# Altium schematic sheet RFID_V2.SchDoc: RFID IC
size 420 x 297 mm; SheetNumber: 2; SheetTotal: 3
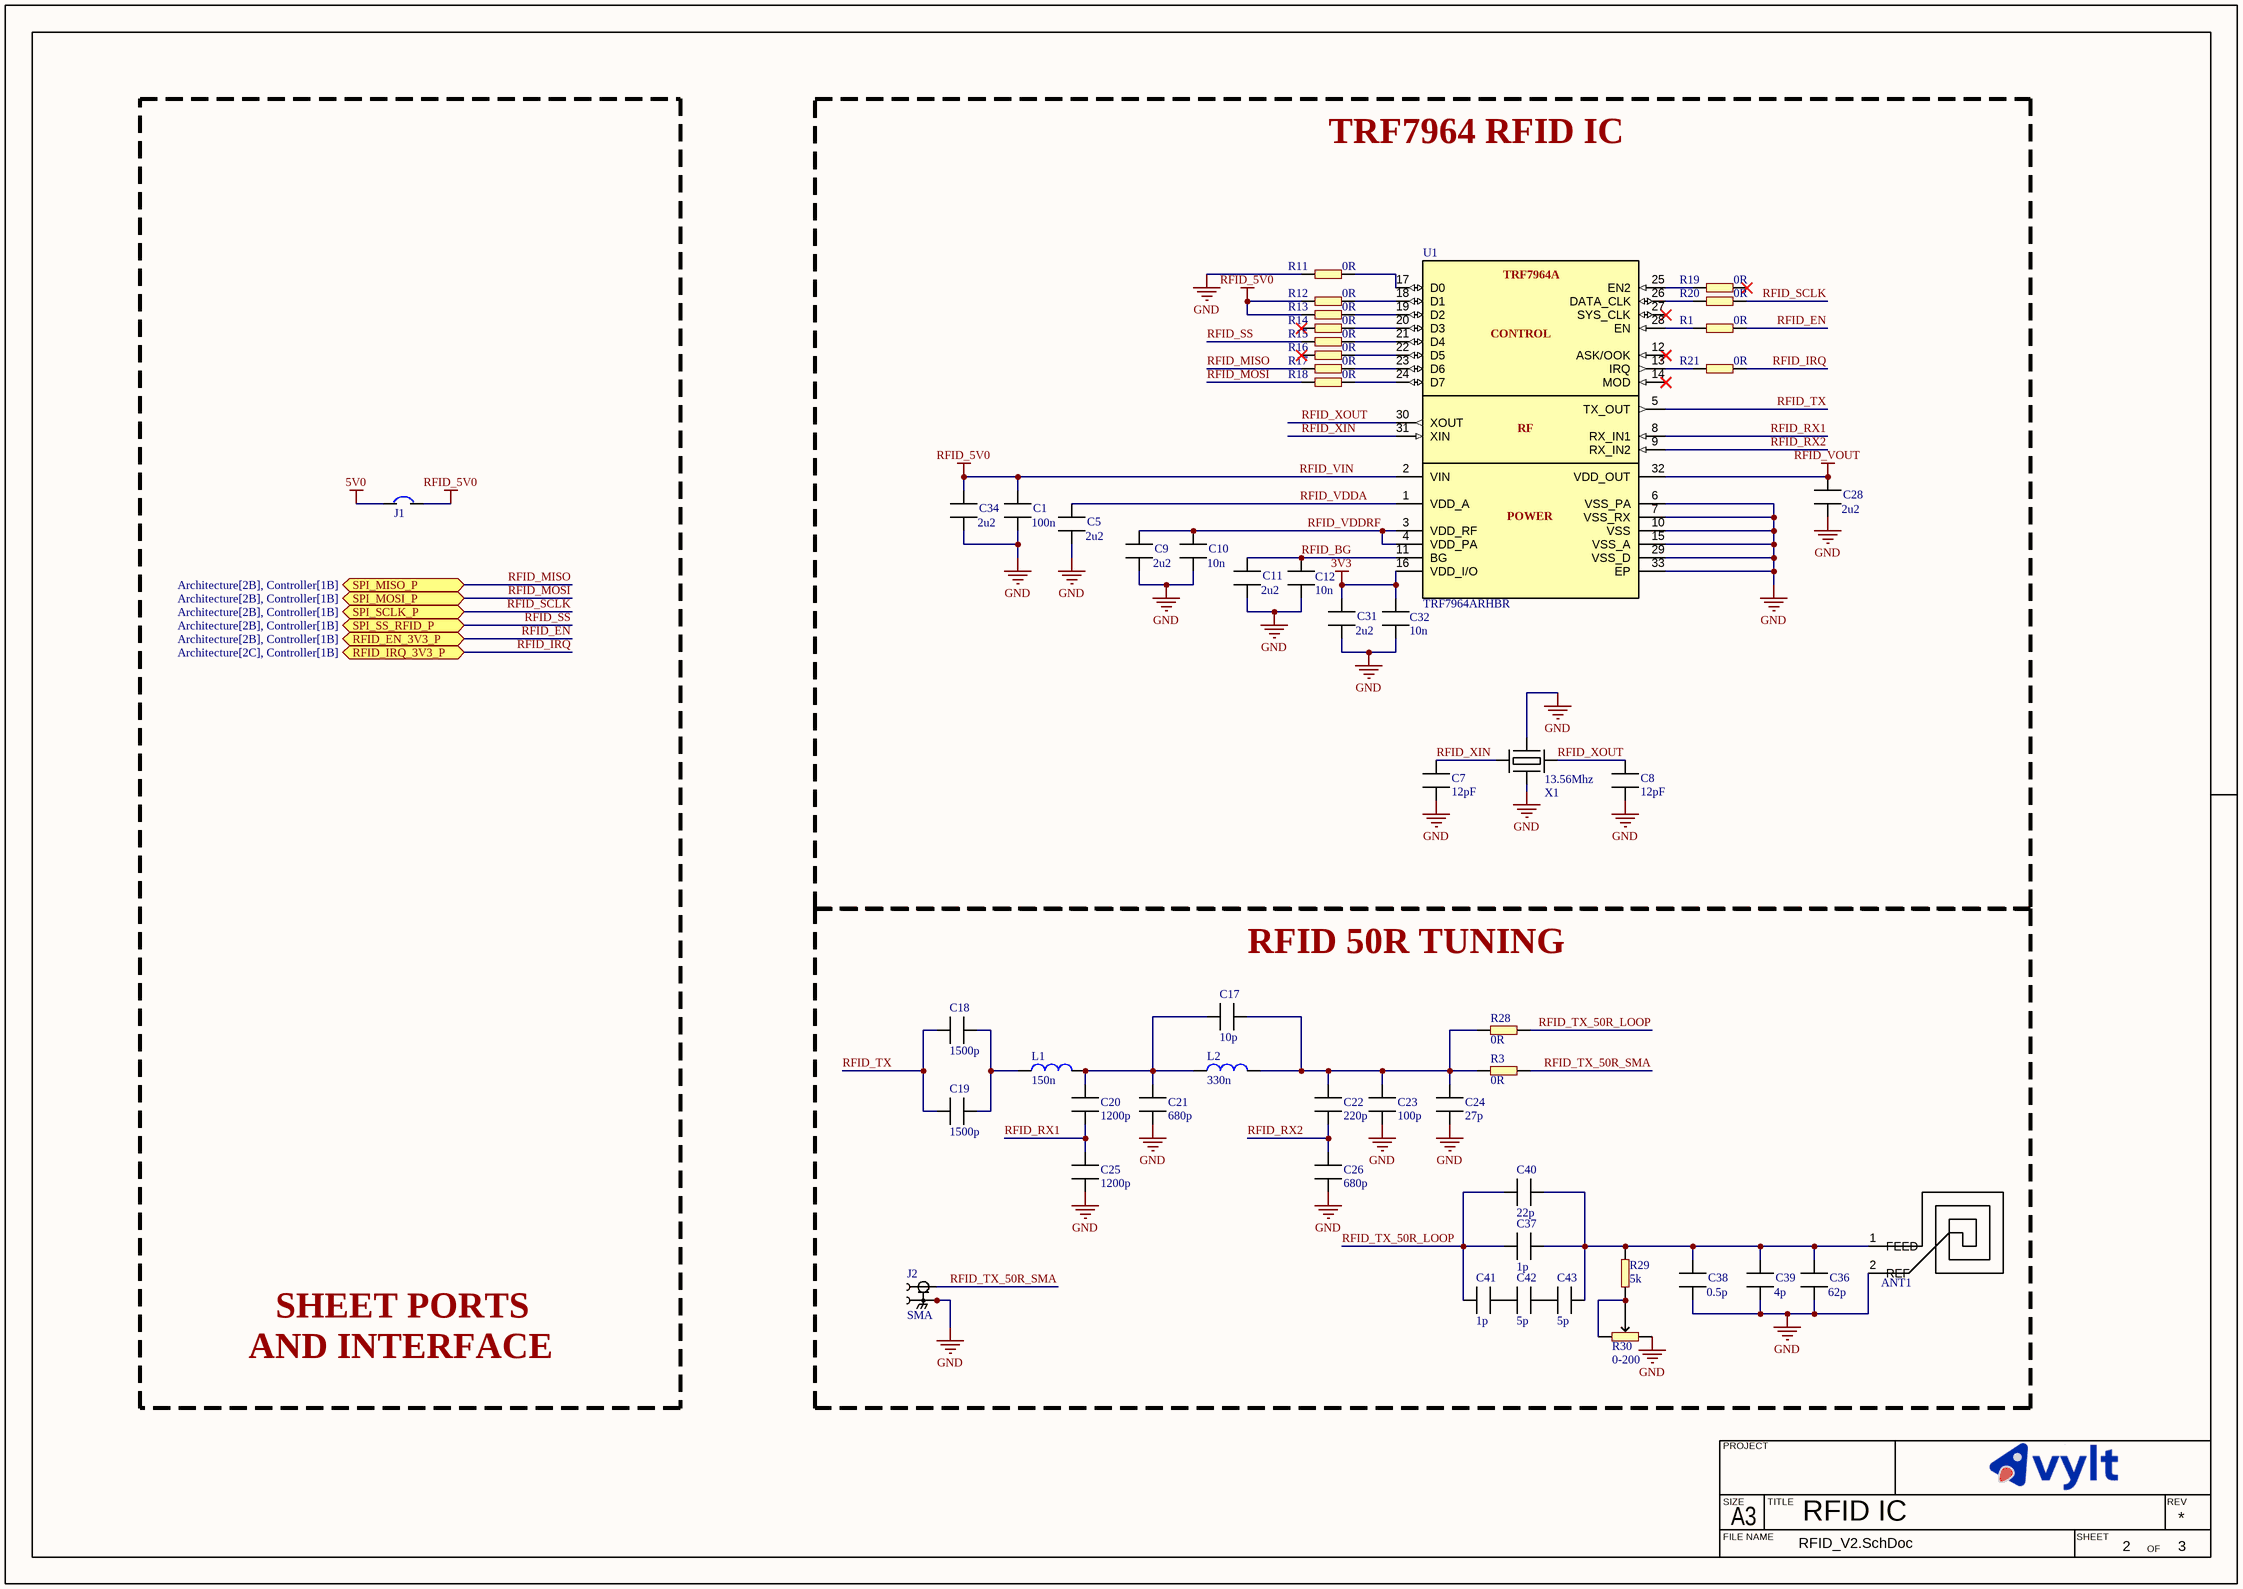
[diagram p0: RFID_V2.SchDoc]

## Parts
ANT1  LOOP_ANT_1.51uH  [LOOP_ANT_1.51uH]  (value not drawn)  (no BOM)
C1  value 100n  [CAPC1608X10N]  (hidden comment: ERP_102-1)
C5  value 2u2  [CAPC1608X10N]  (hidden comment: ERP_102-1)
C7  value 12pF  [CAPC1608X10N]  (hidden comment: ERP_102-1)
C8  value 12pF  [CAPC1608X10N]  (hidden comment: ERP_102-1)
C9  value 2u2  [CAPC1608X10N]  (hidden comment: ERP_102-1)
C10  value 10n  [CAPC1608X10N]  (hidden comment: ERP_102-1)
C11  value 2u2  [CAPC1608X10N]  (hidden comment: ERP_102-1)
C12  value 10n  [CAPC1608X10N]  (hidden comment: ERP_102-1)
C17  value 10p  [CAPC1608X10N]  (hidden comment: ERP_102-1)
C18  value 1500p  [CAPC1608X10N]  (hidden comment: ERP_102-1)
C19  value 1500p  [CAPC1608X10N]  (hidden comment: ERP_102-1)
C20  value 1200p  [CAPC1608X10N]  (hidden comment: ERP_102-1)
C21  value 680p  [CAPC1608X10N]  (hidden comment: ERP_102-1)
C22  value 220p  [CAPC1608X10N]  (hidden comment: ERP_102-1)
C23  value 100p  [CAPC1608X10N]  (hidden comment: ERP_102-1)
C24  value 27p  [CAPC1608X10N]  (hidden comment: ERP_102-1)
C25  value 1200p  [CAPC1608X10N]  (hidden comment: ERP_102-1)
C26  value 680p  [CAPC1608X10N]  (hidden comment: ERP_102-1)
C28  value 2u2  [CAPC1608X10N]  (hidden comment: ERP_102-1)
C31  value 2u2  [CAPC1608X10N]  (hidden comment: ERP_102-1)
C32  value 10n  [CAPC1608X10N]  (hidden comment: ERP_102-1)
C34  value 2u2  [CAPC1608X10N]  (hidden comment: ERP_102-1)
C36  value 62p  [CAPC1608X10N]  (hidden comment: ERP_102-1)
C37  value 1p  [CAPC1608X10N]  (hidden comment: ERP_102-1)
C38  value 0.5p  [CAPC1608X10N]  (hidden comment: ERP_102-1)
C39  value 4p  [CAPC1608X10N]  (hidden comment: ERP_102-1)
C40  value 22p  [CAPC1608X10N]  (hidden comment: ERP_102-1)
C41  value 1p  [CAPC1608X10N]  (hidden comment: ERP_102-1)
C42  value 5p  [CAPC1608X10N]  (hidden comment: ERP_102-1)
C43  value 5p  [CAPC1608X10N]  (hidden comment: ERP_102-1)
J1  Jumper_2P  [Jumper_2P]  (value not drawn)  (no BOM)
J2  value SMA  [SMA_TopEntry_50R]  (hidden comment: SMA_TopEntry_50R)
L1  value 150n  [IND_1008]  (hidden comment: ERP_103-3)
L2  value 330n  [IND_1008]  (hidden comment: ERP_103-3)
R1  value 0R  [RES_0603]  (hidden comment: ERP_101-1)
R3  value 0R  [RES_0603]  (hidden comment: ERP_101-1)
R11  value 0R  [RES_0603]  (hidden comment: ERP_101-1)
R12  value 0R  [RES_0603]  (hidden comment: ERP_101-1)
R13  value 0R  [RES_0603]  (hidden comment: ERP_101-1)
R14  value 0R  [RES_0603]  (hidden comment: ERP_101-1)
R15  value 0R  [RES_0603]  (hidden comment: ERP_101-1)
R16  value 0R  [RES_0603]  (hidden comment: ERP_101-1)
R17  value 0R  [RES_0603]  (hidden comment: ERP_101-1)
R18  value 0R  [RES_0603]  (hidden comment: ERP_101-1)
R19  value 0R  [RES_0603]  (hidden comment: ERP_101-1)
R20  value 0R  [RES_0603]  (hidden comment: ERP_101-1)
R21  value 0R  [RES_0603]  (hidden comment: ERP_101-1)
R28  value 0R  [RES_0603]  (hidden comment: ERP_101-1)
R29  value 5k  [RES_0603]  (hidden comment: ERP_101-1)
R30  value 0-200  [RES_VAR_3361P]  (hidden comment: ERP_101-1)
U1  value TRF7964ARHBR  [RHB32_3P45X3P45_TEX]  (hidden comment: ERP_121-4)
X1  value 13.56Mhz  [CRYS_L3.2_W2.5]  (hidden comment: ERP_111-1)

## Blocks framed on the sheet
TRF7964 RFID IC: C1 C5 C7-C12 C28 C31 C32 C34 R1 R11-R21 U1 X1
RFID 50R TUNING: ANT1 C17-C26 C36-C43 J2 L1 L2 R3 R28-R30

## Ports
RFID_EN_3V3_P (bidir, see Architecture[2B], Controller[1B]), RFID_IRQ_3V3_P (bidir, see Architecture[2C], Controller[1B]), SPI_MISO_P (bidir, see Architecture[2B], Controller[1B]), SPI_MOSI_P (bidir, see Architecture[2B], Controller[1B]), SPI_SCLK_P (bidir, see Architecture[2B], Controller[1B]), SPI_SS_RFID_P (bidir, see Architecture[2B], Controller[1B])

## Nets
3V3: C31.1 C32.1 U1.16(VDD_I/O)
5V0: J1.1
GND: ANT1.2(REF) C1.2 C5.2 C7.2 C8.2 C9.2 C10.2 C11.2 C12.2 C21.1 C23.1 C24.1 C25.1 C26.1 C28.2 C31.2 C32.2 C34.2 C36.2 C38.2 C39.2 J2.2 J2.3 J2.4 J2.5 R11.2 R30.1 U1.6(VSS_PA) U1.7(VSS_RX) U1.10(VSS) U1.15(VSS_A) U1.29(VSS_D) U1.33(EP) X1.2 X1.4
RFID_VIN: C1.1 C34.1 J1.2 R12.2 R13.2 U1.2(VIN)  [also labelled RFID_5V0]
RFID_VOUT: C28.1 U1.32(VDD_OUT)
RFID_BG: C11.1 C12.1 U1.11(BG)
RFID_EN: R1.1 ; port RFID_EN_3V3_P
RFID_IRQ: R21.1 ; port RFID_IRQ_3V3_P
RFID_MISO: R17.2 ; port SPI_MISO_P
RFID_MOSI: R18.2 ; port SPI_MOSI_P
RFID_RX1: C20.1 C25.2 U1.8(RX_IN1)
RFID_RX2: C22.1 C26.2 U1.9(RX_IN2)
RFID_SCLK: R20.1 ; port SPI_SCLK_P
RFID_SS: R15.2 ; port SPI_SS_RFID_P
RFID_TX: C18.1 C19.1 U1.5(TX_OUT)
RFID_TX_50R_LOOP: C37.1 C40.1 C41.1 R28.1
RFID_TX_50R_SMA: J2.1 R3.1
RFID_VDDA: C5.1 U1.1(VDD_A)
RFID_VDDRF: C9.1 C10.1 U1.3(VDD_RF) U1.4(VDD_PA)
RFID_XIN: C7.1 U1.31(XIN) X1.1
RFID_XOUT: C8.1 U1.30(XOUT) X1.3
NetANT1_1: ANT1.1(FEED) C36.1 C37.2 C38.1 C39.1 C40.2 C43.2 R29.2
NetC17_1: C17.1 C22.2 C23.2 C24.2 L2.2 R3.2 R28.2
NetC17_2: C17.2 C20.2 C21.2 L1.2 L2.1
NetC18_2: C18.2 C19.2 L1.1
NetC41_2: C41.2 C42.1
NetC42_2: C42.2 C43.1
NetR1_2: R1.2 U1.28(EN)
NetR11_1: R11.1 U1.17(D0)
NetR12_1: R12.1 U1.18(D1)
NetR13_1: R13.1 U1.19(D2)
NetR14_1: R14.1 U1.20(D3)
NetR15_1: R15.1 U1.21(D4)
NetR16_1: R16.1 U1.22(D5)
NetR17_1: R17.1 U1.23(D6)
NetR18_1: R18.1 U1.24(D7)
NetR19_2: R19.2 U1.25(EN2)
NetR20_2: R20.2 U1.26(DATA_CLK)
NetR21_2: R21.2 U1.13(IRQ)
NetR29_1: R29.1 R30.2 R30.3

Not connected (* = marked no-connect by the designer): R14 2*; R16 2*; R19 1*; U1 12(ASK/OOK)* 14(MOD)* 27(SYS_CLK)*

## Notes on the sheet
- SHEET PORTS
- AND INTERFACE
- PROJECT
- SIZE
- FILE NAME
- A3
- TITLE
- SHEET
- OF
- REV
- (in symbol TRF7964A) CONTROL; RF; POWER

## Library data of the parts
ANT1 = LOOP_ANT_1.51uH: LOOP_ANT_1.51uH_4t_40L_45W_0.4W_0.8P
C1 = MLCC_0603: MLCC 0603; Manufacturer 1: Murata; Manufacturer Part Number 1: CC0603JRX7R9BB104; Package: 0603; Supplier 1: *; Suuplier Part Number 1: *; ERP: *
C5 C9 C11 C28 C31 C34 = MLCC_0603: MLCC 0603; Manufacturer 1: Murata Electronics; Manufacturer Part Number 1: GRT188R61H225KE13D; Package: 0603; Suuplier Part Number 1: *; ERP: *; Supplier 1: Digikey; Supplier Part Number 1: 490-12332-1-ND
C7 C8 = MLCC_0603: MLCC 0603; Manufacturer 1: Yageo; Manufacturer Part Number 1: CC0603JPNPO9BN120; Package: 0603; Suuplier Part Number 1: *; ERP: *; Supplier 1: Digikey; Supplier Part Number 1: 13-CC0603JPNPO9BN120CT-ND
C10 C12 C32 = MLCC_0603: MLCC 0603; Manufacturer 1: Murata; Manufacturer Part Number 1: GRM1885C1H103JA01D; Package: 0603; Suuplier Part Number 1: *; ERP: *; Supplier 1: Digikey; Supplier Part Number 1: 490-9666-1-ND
C17 = MLCC_0603: MLCC 0603; Manufacturer 1: Yageo; Manufacturer Part Number 1: CC0603FRNPO9BN100; Package: 0603; Suuplier Part Number 1: *; ERP: *; Supplier 1: Digikey; Supplier Part Number 1: 311-3349-1-ND
C18 C19 = MLCC_0603: MLCC 0603; Manufacturer 1: Murata; Manufacturer Part Number 1: GRM1885C1H152FA01D; Package: 0603; Suuplier Part Number 1: *; ERP: *; Supplier 1: Digikey; Supplier Part Number 1: 490-11446-1-ND
C20 C25 = MLCC_0603: MLCC 0603; Manufacturer 1: Murata; Manufacturer Part Number 1: GCM1885C1H122FA16D; Package: 0603; Suuplier Part Number 1: *; ERP: *; Supplier 1: Digikey; Supplier Part Number 1: 490-GCM1885C1H122FA16DCT-ND
C21 C26 = MLCC_0603: MLCC 0603; Manufacturer 1: Yageo; Manufacturer Part Number 1: CC0603FRNPO9BN681; Package: 0603; Suuplier Part Number 1: *; ERP: *; Supplier 1: Digikey; Supplier Part Number 1: 311-3905-1-ND
C22 = MLCC_0603: MLCC 0603; Manufacturer 1: Yageo; Manufacturer Part Number 1: CC0603FRNPO9BN221; Package: 0603; Suuplier Part Number 1: *; ERP: *; Supplier 1: Digikey; Supplier Part Number 1: 311-3891-1-ND
C23 = MLCC_0603: MLCC 0603; Manufacturer 1: Yageo; Manufacturer Part Number 1: CC0603FRNPO9BN101; Package: 0603; Suuplier Part Number 1: *; ERP: *; Supplier 1: Digikey; Supplier Part Number 1: 311-3599-1-ND
C24 = MLCC_0603: MLCC 0603; Manufacturer 1: Yageo; Manufacturer Part Number 1: CC0603FRNPO9BN270; Package: 0603; Suuplier Part Number 1: *; ERP: *; Supplier 1: Digikey; Supplier Part Number 1: 311-3892-1-ND
C36 = MLCC_0603: Chip Capacitor, 2-Leads, Body 1.60x0.80mm, IPC Medium Density; Manufacturer 1: KEMET; Manufacturer Part Number 1: CBR06C620F5GAC; Package: 0603; Suuplier Part Number 1: *; ERP: *
C37 C41 = MLCC_0603: Chip Capacitor, 2-Leads, Body 1.60x0.80mm, IPC Medium Density; Manufacturer 1: KEMET; Manufacturer Part Number 1: CBR06C109B5GAC; Package: 0603; Suuplier Part Number 1: *; ERP: *; Supplier 1: Digikey; Supplier Part Number 1: 399-CBR06C109B5GACCT-ND
C38 = MLCC_0603: Chip Capacitor, 2-Leads, Body 1.60x0.80mm, IPC Medium Density; Manufacturer 1: KEMET; Manufacturer Part Number 1: CBR06C508B5GAC; Package: 0603; Suuplier Part Number 1: *; ERP: *; Supplier 1: Digikey; Supplier Part Number 1: 399-13249-1-ND
C39 = MLCC_0603: Chip Capacitor, 2-Leads, Body 1.60x0.80mm, IPC Medium Density; Manufacturer 1: KEMET; Manufacturer Part Number 1: CBR06C409B5GAC; Package: 0603; Suuplier Part Number 1: *; ERP: *; Supplier 1: Digikey; Supplier Part Number 1: 399-CBR06C409B5GACCT-ND
C40 = MLCC_0603: Chip Capacitor, 2-Leads, Body 1.60x0.80mm, IPC Medium Density; Manufacturer 1: KEMET; Manufacturer Part Number 1: CBR06C220J5GACAUTO; Package: 0603; Suuplier Part Number 1: *; ERP: *; Supplier 1: Digikey; Supplier Part Number 1: 399-CBR06C220J5GACAUTOCT-ND
C42 C43 = MLCC_0603: Chip Capacitor, 2-Leads, Body 1.60x0.80mm, IPC Medium Density; Manufacturer 1: KEMET; Manufacturer Part Number 1: CBR06C509A5GAC; Package: 0603; Suuplier Part Number 1: *; ERP: *; Supplier 1: Digikey; Supplier Part Number 1: 399-17323-1-ND
J1 = Jumper_2P: Jumper 2 Pins
J2 = SMA_TopEntry_50R: SMA STR PCB SKT GZD; Manufacturer Part Number 1: 5-1814832-2; Manufacturer 1: TE; Supplier Part Number 1: *; Supplier 1: Digikey; ERP: *; Package: SMA
L1 = IND_1008: Manufacturer Part Number 1: LQW2UASR15F00L; Manufacturer 1: Murata Electronics; ERP: *; Suuplier Part Number 1: *; Package: 1008; Supplier 1: Digikey; Supplier Part Number 1: 490-16089-1-ND
L2 = IND_1008: Manufacturer Part Number 1: LQW2UASR33F00L; Manufacturer 1: Murata Electronics; ERP: *; Suuplier Part Number 1: *; Supplier 1: *; Package: 1008
R1 R3 R11-R21 R28 = RES_0603: Manufacturer 1: Yageo; Manufacturer Part Number 1: RC0603JR-070RL; Package: 0603; Suuplier Part Number 1: *; ERP: *; Supplier 1: Digikey; Supplier Part Number 1: 311-0.0GRCT-ND
R29 = RES_0603: Manufacturer 1: YAGEO; Manufacturer Part Number 1: RT0603BRE075KL; Package: 0603; ERP: *; Supplier 1: *; Supplier Part Number 1: *; Supplier 2: Digikey; Supplier Part Number 2: 13-RT0603BRE075KLCT-ND
R30 = RES_VAR_3361P: TRIMMER 200 OHM 0.5W GW TOP ADJ; Manufacturer 1: Bourns Inc.; Manufacturer Part Number 1: 3361P-1-201GLF; Package: L7.0XW6.7; ERP: *; Supplier 1: *; Supplier Part Number 1: *; Supplier 2: Digikey; Supplier Part Number 2: 3361P-201GLFCT-ND
U1 = TRF7964A: IC RFID READER 13.56MHZ 32VQFN; Manufacturer 1: TI; Manufacturer Part Number 1: TRF7964ARHBR; Package: VQFN32; Suuplier Part Number 1: *; ERP: *; Supplier 1: Digikey; Supplier Part Number 1: 296-35671-1-ND
X1 = CRYS_L3.2_W2.5: Manufacturer Part Number 1: ABM8G-13.560MHZ-18-D2Y-T; Manufacturer 1: Abracon LLC; Package: L2W1.6-4; ERP: *; Supplier 1: *; Supplier Part Number 1: *; Supplier 2: Digikey; Supplier Part Number 2: 535-10264-1-ND